# Altium schematic sheet neke_blokade.SchDoc
size A4
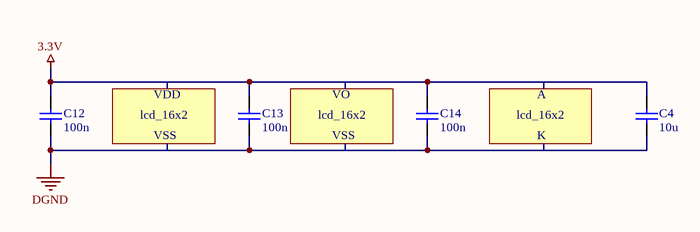
[diagram p0: neke_blokade.SchDoc]

## Parts
C4  10u  [6-0805_N]
C12  100n  [6-0805_N]
C13  100n  [6-0805_N]
C14  100n  [6-0805_N]

## Nets
3.3V: C4.2 C12.2 C13.2 C14.2
DGND: C4.1 C12.1 C13.1 C14.1

## Notes on the sheet
- lcd_16x2
- VDD
- VO
- A
- VSS
- K

## Library data of the parts
C4 C12-C14 = Cap: Keramički kondezator; Cijena: 0.41; Dobavljač: Farnell; Kataloški broj: 3019949